# EasyEDA Pro project 步进电机天空星转接板.eprj, board PCB1
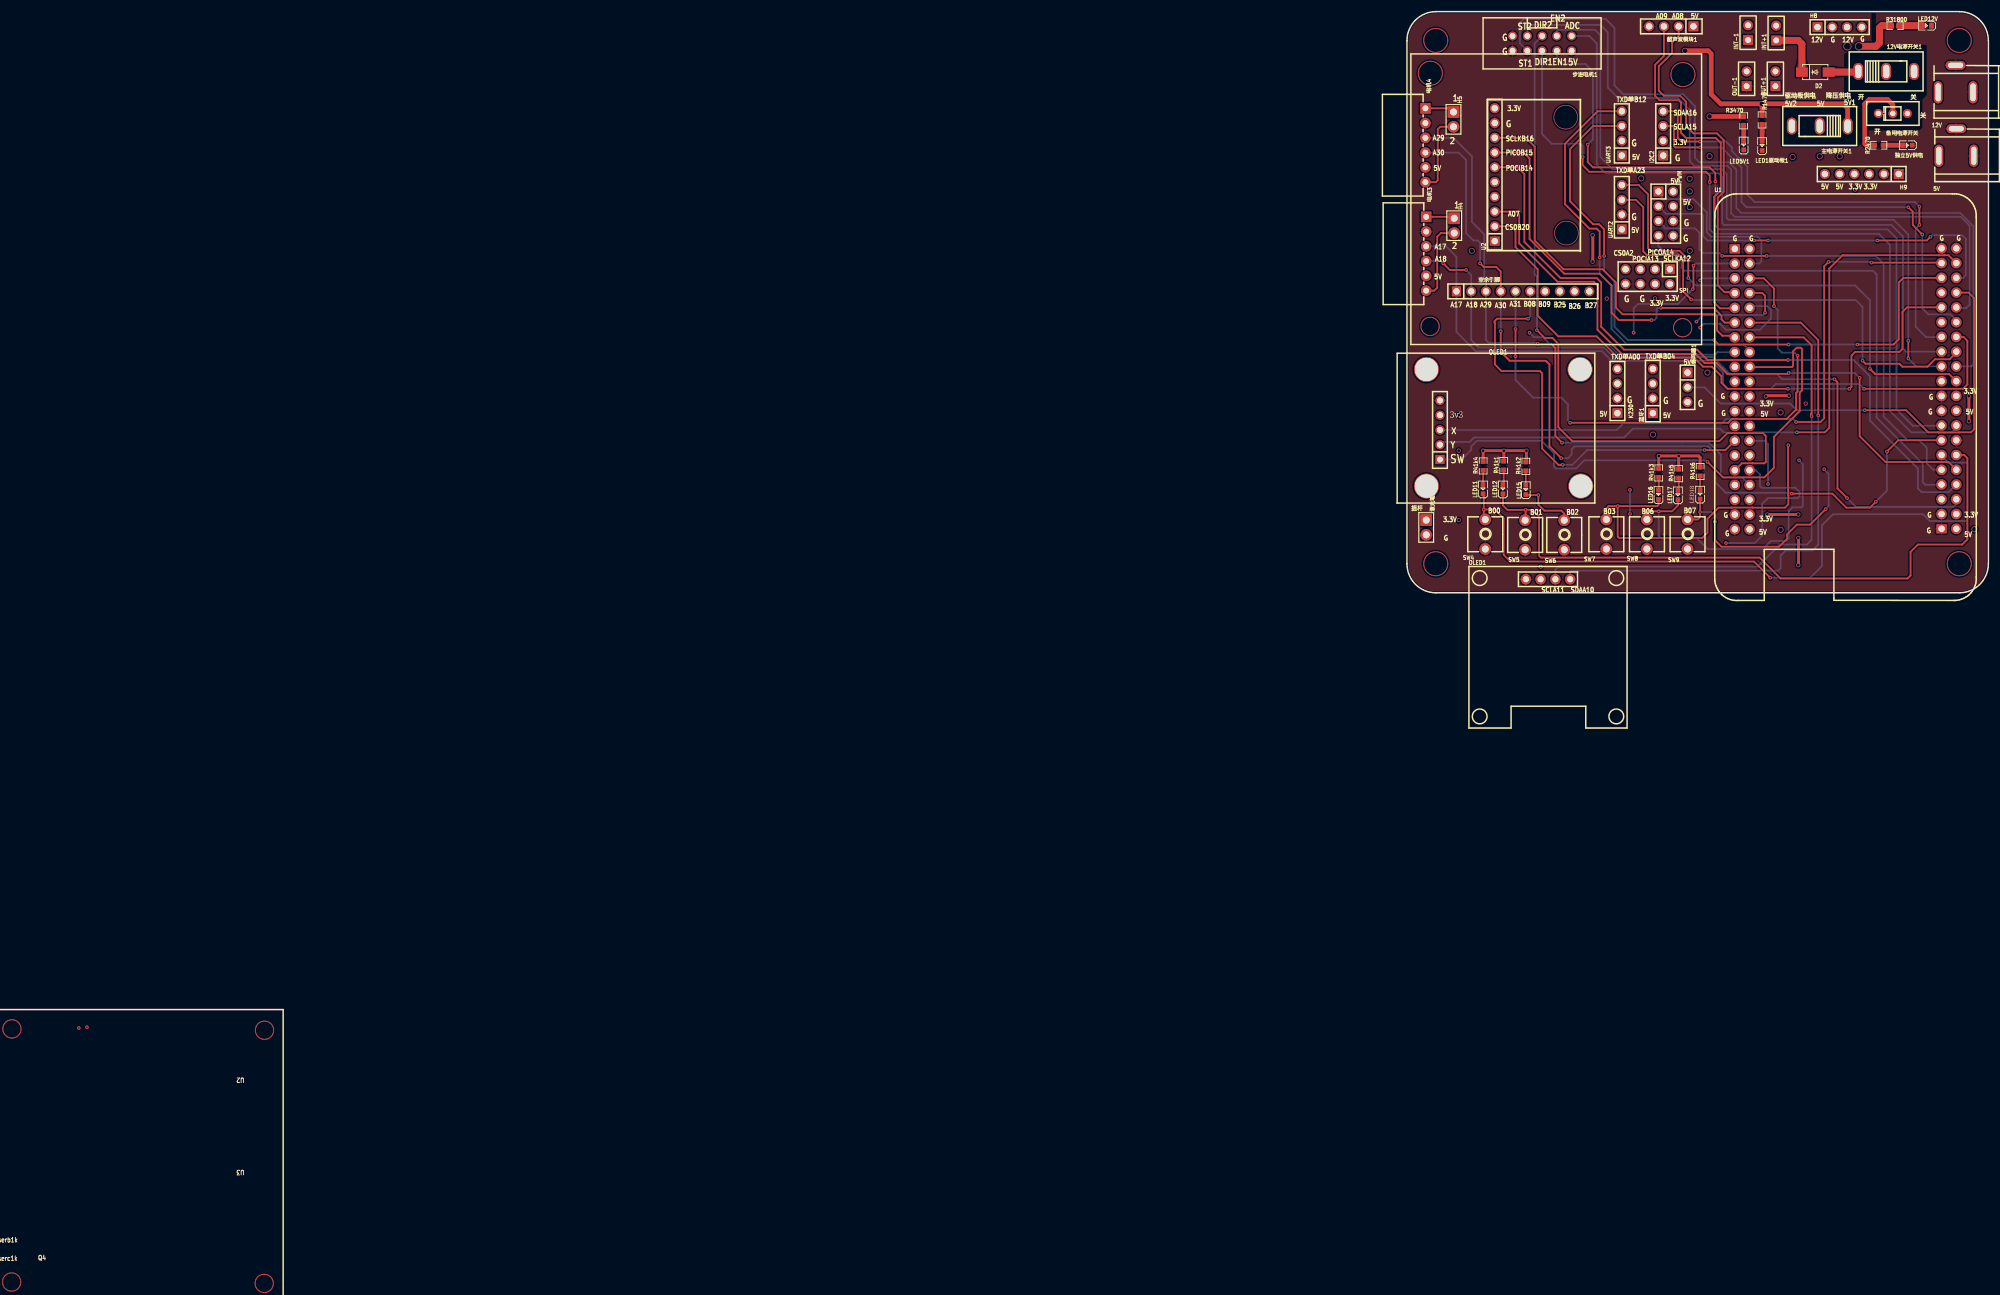
[diagram p2: board, top side]
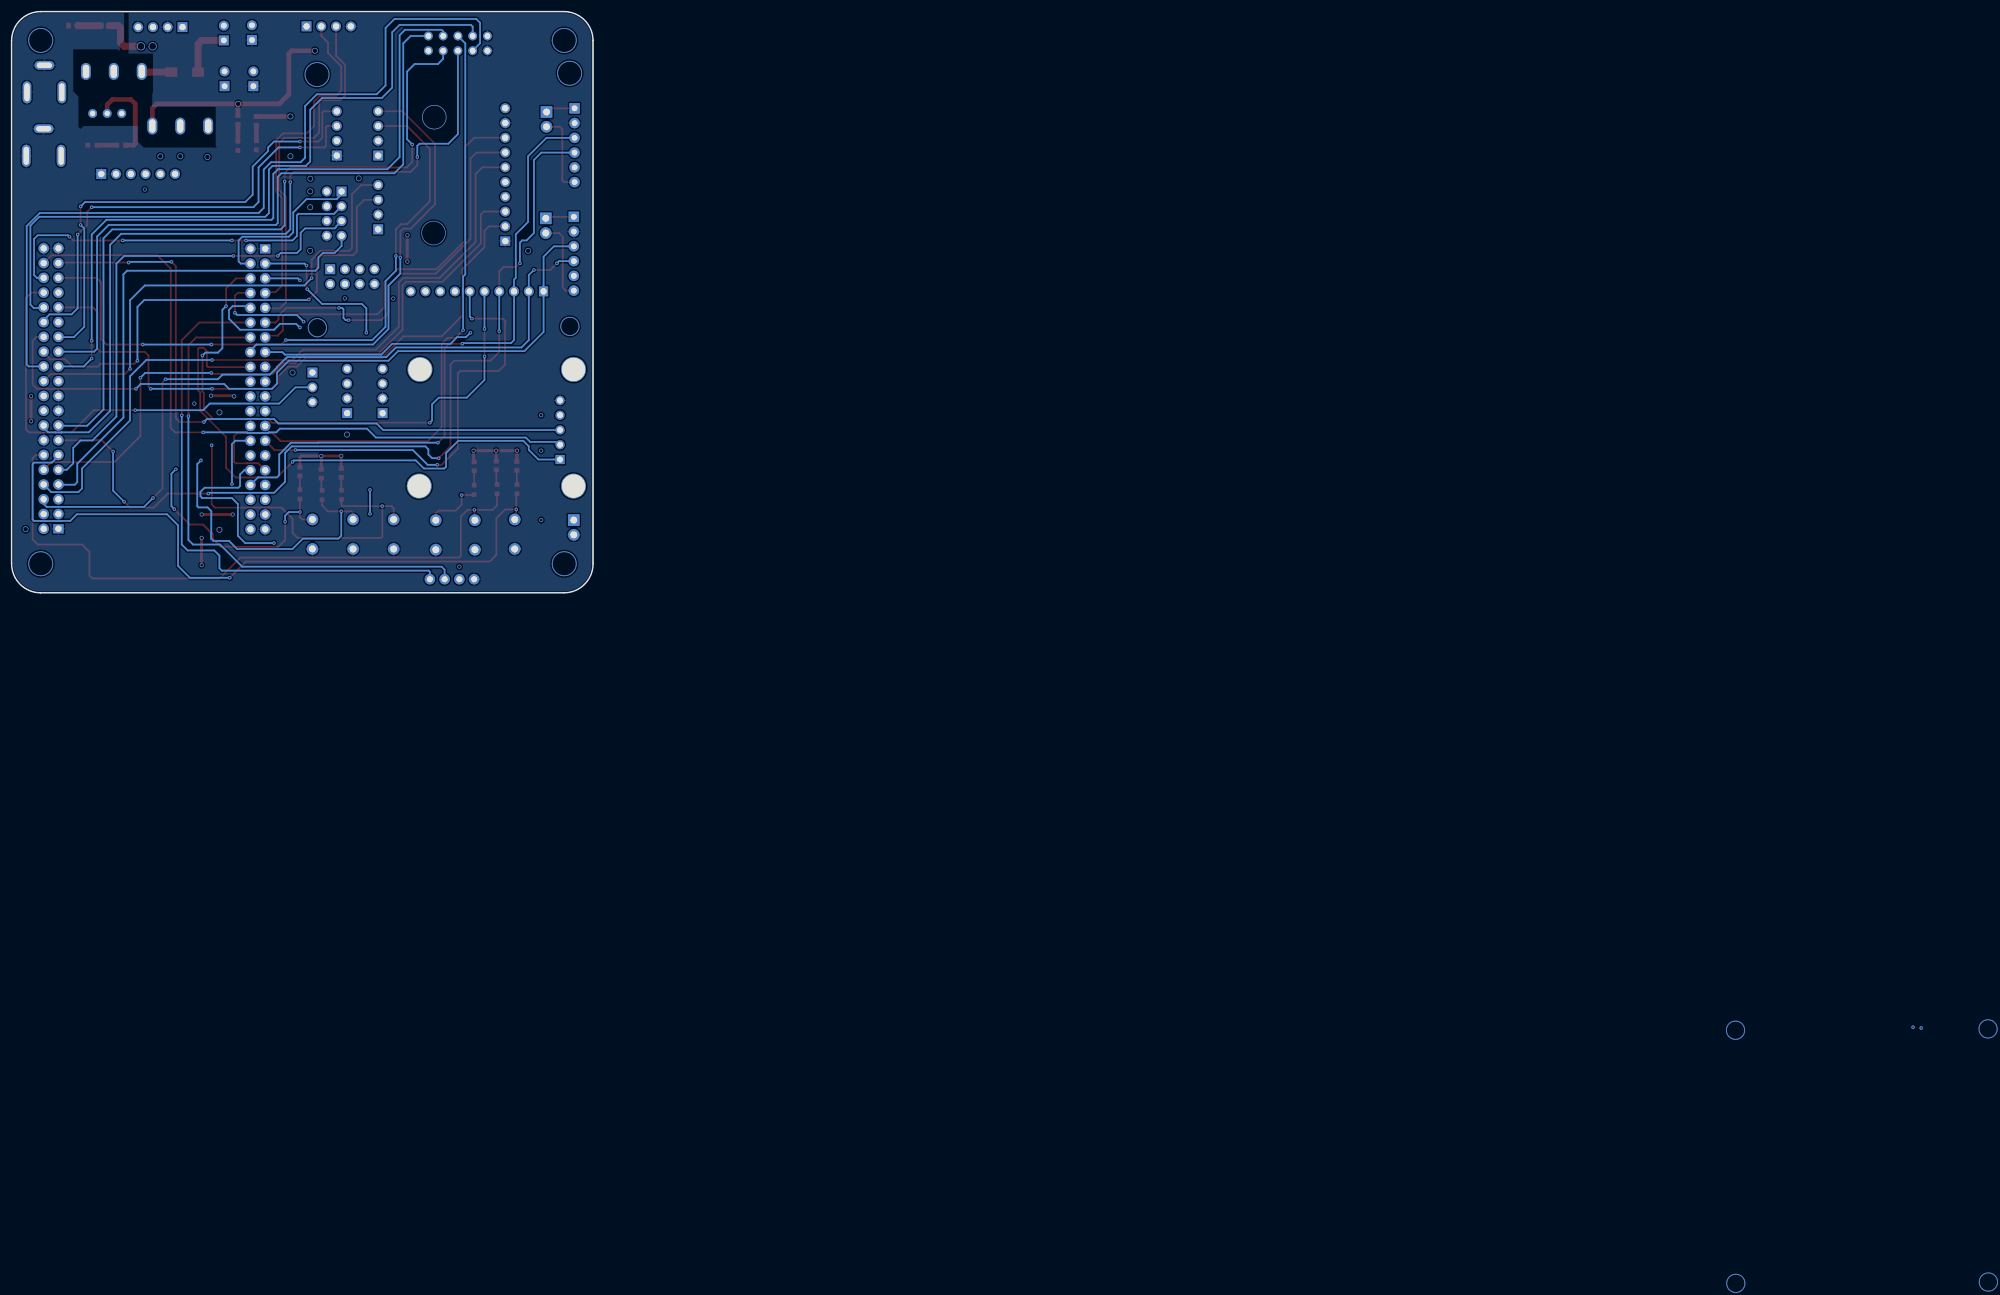
[diagram p3: board, bottom side, seen from below]

Outline 100 x 100 mm; copper layers: Top Layer, Inner1, Inner2, Bottom Layer. Coordinates in mm from the lower left corner of the outline.
Outline path: 0,95 0,5 arc(1.46,1.46) 5,0 95,0 arc(98.54,1.46) 100,5 100,95 arc(98.54,98.54) 95,100 5,100 arc(1.46,98.54) 0,95
Stack: Top Layer 0.035mm 外层铜厚1oz / Dielectric1 0.2104mm 7628 RC49% 8.6mil / Inner1 0.0152mm 内层铜厚 / Dielectric2 1.065mm 1.1mm H/HOZ Copper / Inner2 0.0152mm 内层铜厚 / Dielectric3 0.2104mm 7628 RC49% 8.6mil / Bottom Layer 0.035mm 外层铜厚1oz

## Design rules (mm)
template: 自定义配置
spacing copperThickness1oz (default): track to track 0.102, other pairs 0.152 to 0.3
spacing copperThickness2oz: track to track 0.203, other pairs 0.152 to 0.3
track width copperThickness1oz (default): min 0.3, default 0.3, max 2.54
track width copperThickness2oz: min 0.203, default 0.254, max 2.54
differential pair differentialPair (default): width min 0.127, default 0.254, max 2.54; gap min 0.152, default 0.152
via viaSize (default): diameter min 0.5, default 0.61, max 10; hole min 0.3, default 0.305, max 6.3

## Placement (name value [footprint] x y rotation side)
5V  DC005-T25  [DC-IN-TH_DC-005-20A-1]  94.49 77.52 180 top
12V  DC005-T25  [DC-IN-TH_DC-005-20A-1]  94.36 88.44 180 top
12V电源开关1  SS12D10G5  [SW-TH_SHOU-HAN_SS12D10G4]  82.42 89.71 0 top
D2  SS54  [SMA_L4.3-W2.6-LS5.0-FD]  70.23 89.59 180 top
H4  PZ254V-11-02P  [HDR-TH_2P-P2.54-V-M]  8.13 63.17 270 top
H5  PZ254V-11-02P  [HDR-TH_2P-P2.54-V-M]  8 81.46 270 top
H8  PZ254V-11-04P  [HDR-TH_4P-P2.54-V-M]  74.42 97.33 0 top
H9  PZ254V-11-06P  [HDR-TH_6P-P2.54-V-M]  78.23 72.06 180 top
I2C2  PZ254V-11-04P  [HDR-TH_4P-P2.54-V-M]  44.07 79.05 90 top
INT+1  2.54-1*2P母  [HDR-TH_2P-P2.54-V-F]  63.5 96.32 90 top
INT-1  2.54-1*2P母  [HDR-TH_2P-P2.54-V-F]  58.68 96.38 90 top
K230  PZ254V-11-04P  [HDR-TH_4P-P2.54-V-M]  36.19 34.72 90 top
LED1驱动板1  LTST-C191KSKT  [LED0603-RD-YELLOW#2]  61.09 76.9 90 top
LED5V1  LTST-C191KSKT  [LED0603-RD-YELLOW#2]  57.91 77.01 90 top
LED11  LTST-C191KSKT  [LED0603-RD-YELLOW#2]  13.08 17.83 90 top
LED12  LTST-C191KSKT  [LED0603-RD-YELLOW#2]  16.51 17.83 90 top
LED12V  LTST-C191KSKT  [LED0603-RD-YELLOW]  89.41 97.59 180 top
LED15  LTST-C191KSKT  [LED0603-RD-YELLOW#2]  20.45 17.7 90 top
LED16  LTST-C191KSKT  [LED0603-RD-YELLOW#2]  43.26 16.87 90 top
LED17  LTST-C191KSKT  [LED0603-RD-YELLOW#2]  46.61 16.81 90 top
LED18  LTST-C191KSKT  [LED0603-RD-YELLOW#2]  50.42 16.94 90 top
NOREF  -  [Pad_e98]  29.77 38.43 180 top
NOREF#2  -  [Pad_e97]  29.9 18.37 180 top
NOREF#3  -  [Pad_e100]  3.35 18.37 180 top
NOREF#4  -  [Pad_e99]  3.35 38.43 180 top
OLED1  HS96L03W2C03  [OLED-TH_L27.8-W27.2-P2.54_C9900033791]  24.26 2.34 0 top
OUT+1  2.54-1*2P母  [HDR-TH_2P-P2.54-V-F]  63.37 88.44 90 top
OUT-1  2.54-1*2P母  [HDR-TH_2P-P2.54-V-F]  58.42 88.44 90 top
PWM  PWM  [HDR-TH_8P-P2.54-V-M-R2-C4-S2.54]  44.52 65.24 270 top
R41k1  1kΩ  [R0603#2]  16.64 21.9 90 top
R41k2  1kΩ  [R0603#2]  20.45 21.77 90 top
R41k3  1kΩ  [R0603#2]  43.31 20.62 90 top
R41k4  1kΩ  [R0603#2]  13.11 21.83 90 top
R41k5  1kΩ  [R0603#2]  46.74 20.5 90 top
R41k6  1kΩ  [R0603#2]  50.43 20.87 90 top
R1470  470Ω  [R0603#2]  61.08 81.36 270 top
R2470  470Ω  [R0603#2]  81.15 77.01 0 top
R3470  470Ω  [R0603#2]  57.91 81.2 270 top
R31800  470Ω  [R0603]  83.95 97.59 0 top
SPI  PZ254V-12-8P  [HDR-TH_8P-P2.54-V-M-R2-C4-S2.54]  41.4 54.41 180 top
SW4  K2-1104DZ-G4SW-04  [KEY-TH_2P-L6.0-W6.0-P5.00]  13.46 10.08 90 top
SW5  K2-1104DZ-G4SW-04  [KEY-TH_2P-L6.0-W6.0-P5.00]  20.32 9.96 90 top
SW6  K2-1104DZ-G4SW-04  [KEY-TH_2P-L6.0-W6.0-P5.00]  27.05 9.96 90 top
SW7  K2-1104DZ-G4SW-04  [KEY-TH_2P-L6.0-W6.0-P5.00]  34.29 10.08 90 top
SW8  K2-1104DZ-G4SW-04  [KEY-TH_2P-L6.0-W6.0-P5.00]  41.28 10.08 90 top
SW9  K2-1104DZ-G4SW-04  [KEY-TH_2P-L6.0-W6.0-P5.00]  48.26 10.08 90 top
U1  LCKFB-TMX-MSPM0G3507  [COMM-TH_LCKFB-TMX-MSPM0G3507]  75.44 35.1 0 top
U2  PM2.54-1*10  [HDR-TH_10P-P2.54-V-F]  15.1 71.95 90 top
UART2  2.54-1*4P母  [HDR-TH_4P-P2.54-V-F]  36.96 66.34 90 top
UART3  PZ254V-11-04P  [HDR-TH_4P-P2.54-V-M]  36.96 79.05 90 top
主电源开关1  SS12D10G5  [SW-TH_SHOU-HAN_SS12D10G4]  70.99 80.31 180 top
备用电源开关  SS-12D00-G3  [SW-TH_3P-L8.8-W3.9-P2.50_SS12D00G3]  83.57 82.47 0 top
摇杆1  2.54-1*5P母  [HDR-TH_5P-P2.54-V-F]  5.67 28.02 90 top
步进电机1  2.54-2*5P简牛  [IDC-TH_10P-P2.54_C5665]  23.24 94.54 180 top
激光笔1  PZ254V-11-02P  [HDR-TH_2P-P2.54-V-M]  3.31 11.25 270 top
独立5V供电  LTST-C191KSKT  [LED0603-RD-YELLOW#2]  86.11 77.01 180 top
电机3  XH-6AW  [CONN-TH_6P-P2.54_HCTL_XH-6AW_C2908615]  3.3 58.34 270 top
电机4  XH-6AW  [CONN-TH_6P-P2.54_HCTL_XH-6AW_C2908615]  3.17 77.01 270 top
空余引脚  空余引脚  [HDR-TH_10P-P2.54-V-M]  19.94 51.87 0 top
蓝牙1  2.54-1*4P母  [HDR-TH_4P-P2.54-V-F]  42.29 34.72 90 top
蜂鸣器1  PZ254V-11-03P  [HDR-TH_3P-P2.54-V-M]  48.26 35.36 270 top
超声波模块1  KH-2.54FH-1X4P-H8.5  [HDR-TH_4P-P2.54-V-F]  45.47 97.46 180 top

## Footprints (pads in the part's own frame, mm; a bottom-side part is the same pattern mirrored in y, then rotated)
COMM-TH_LCKFB-TMX-MSPM0G3507
  rect 1.8x1.575 hole 1.1: 1(-19.05,24.09) 41(16.51,-24.09)
  round 1.8 hole 1.1: 2(-16.51,24.09) 3(-19.05,21.549) 4(-16.51,21.549) 5(-19.05,19.009) 6(-16.51,19.009) 7(-19.05,16.47) 8(-16.51,16.47) 9(-19.05,13.93) 10(-16.51,13.93) 11(-19.05,11.389) 12(-16.51,11.389) 13(-19.05,8.85) 14(-16.51,8.85) 15(-19.05,6.309) 16(-16.51,6.309) 17(-19.05,3.769) 18(-16.51,3.769) 19(-19.05,1.23) 20(-16.51,1.23) 21(-19.05,-1.31) 22(-16.51,-1.31) 23(-19.05,-3.85) 24(-16.51,-3.85) 25(-19.05,-6.391) 26(-16.51,-6.391) 27(-19.05,-8.931) 28(-16.51,-8.931) 29(-19.05,-11.47) 30(-16.51,-11.47) 31(-19.05,-14.011) 32(-16.51,-14.011) 33(-19.05,-16.55) 34(-16.51,-16.55) 35(-19.05,-19.09) 36(-16.51,-19.09) 37(-19.05,-21.631) 38(-16.51,-21.631) 39(-19.05,-24.171) 40(-16.51,-24.171) 42(19.05,-24.09) 43(16.51,-21.549) 44(19.05,-21.549) 45(16.51,-19.009) 46(19.05,-19.009) 47(16.51,-16.47) 48(19.05,-16.47) 49(16.51,-13.93) 50(19.05,-13.93) 51(16.51,-11.389) 52(19.05,-11.389) 53(16.51,-8.85) 54(19.05,-8.85) 55(16.51,-6.309) 56(19.05,-6.309) 57(16.51,-3.769) 58(19.05,-3.769) 59(16.51,-1.23) 60(19.05,-1.23) 61(16.51,1.31) 62(19.05,1.31) 63(16.51,3.85) 64(19.05,3.85) 65(16.51,6.391) 66(19.05,6.391) 67(16.51,8.931) 68(19.05,8.931) 69(16.51,11.47) 70(19.05,11.47) 71(16.51,14.011) 72(19.05,14.011) 73(16.51,16.55) 74(19.05,16.55) 75(16.51,19.09) 76(19.05,19.09) 77(16.51,21.631) 78(19.05,21.631) 79(16.51,24.171) 80(19.05,24.171)
CONN-TH_6P-P2.54_HCTL_XH-6AW_C2908615
  rect 1.8x1.8 hole 1: 1(-6.35,0)
  round 1.8 hole 1: 2(-3.81,0) 3(-1.27,0) 4(1.27,0) 5(3.81,0) 6(6.35,0)
DC-IN-TH_DC-005-20A-1
  oval 1.5x3.8 hole 0.9x3.1: 1(3,2.325) 2(-3,2.325)
  oval 3.4x1.5 hole 2.6x0.9: 3(0,-2.325)
HDR-TH_2P-P2.54-V-F
  rect 1.7x1.7 hole 1: 1(-1.27,0)
  round 1.7 hole 1: 2(1.27,0)
HDR-TH_2P-P2.54-V-M
  rect 2x2 hole 1.2: 1(-1.27,0)
  round 2 hole 1.2: 2(1.27,0)
HDR-TH_3P-P2.54-V-M
  rect 1.7x1.7 hole 1.1: 1(-2.54,0)
  round 1.7 hole 1.1: 2(0,0) 3(2.54,0)
HDR-TH_4P-P2.54-V-F
  rect 1.7x1.7 hole 1.1: 1(-3.81,0)
  round 1.7 hole 1.1: 2(-1.27,0) 3(1.27,0) 4(3.81,0)
HDR-TH_4P-P2.54-V-M
  rect 1.7x1.7 hole 1.1: 1(-3.81,0)
  round 1.7 hole 1.1: 2(-1.27,0) 3(1.27,0) 4(3.81,0)
HDR-TH_5P-P2.54-V-F
  rect 1.575x1.575 hole 1.02: 1(-5.08,0)
  round 1.575 hole 1.02: 2(-2.54,0) 3(0,0) 4(2.54,0) 5(5.08,0)
HDR-TH_6P-P2.54-V-M
  rect 1.7x1.7 hole 1.1: 1(-6.35,0)
  round 1.7 hole 1.1: 2(-3.81,0) 3(-1.27,0) 4(1.27,0) 5(3.81,0) 6(6.35,0)
HDR-TH_8P-P2.54-V-M-R2-C4-S2.54
  rect 1.7x1.7 hole 1.1: 1(-3.81,-1.27)
  round 1.7 hole 1.1: 2(-3.81,1.27) 3(-1.27,-1.27) 4(-1.27,1.27) 5(1.27,-1.27) 6(1.27,1.27) 7(3.81,-1.27) 8(3.81,1.27)
HDR-TH_10P-P2.54-V-F
  rect 1.575x1.7 hole 1.1: 1(-11.43,0)
  round 1.7 hole 1.1: 2(-8.89,0) 3(-6.35,0) 4(-3.81,0) 5(-1.27,0) 6(1.27,0) 7(3.81,0) 8(6.35,0) 9(8.89,0) 10(11.43,0)
HDR-TH_10P-P2.54-V-M
  rect 1.575x1.7 hole 1.1: 1(-11.43,0)
  round 1.7 hole 1.1: 2(-8.89,0) 3(-6.35,0) 4(-3.81,0) 5(-1.27,0) 6(1.27,0) 7(3.81,0) 8(6.35,0) 9(8.89,0) 10(11.43,0)
IDC-TH_10P-P2.54_C5665
  round 1.524 hole 1: 1(-5.08,-1.27) 2(-5.08,1.27) 3(-2.54,-1.27) 4(-2.54,1.27) 5(0,-1.27) 6(0,1.27) 7(2.54,-1.27) 8(2.54,1.27) 9(5.08,-1.27) 10(5.08,1.27)
KEY-TH_2P-L6.0-W6.0-P5.00
  round 2 hole 1.2: 1(-2.54,0) 2(2.54,0)
LED0603-RD-YELLOW
  rect 0.8x1 smd: 1(-0.799,-0.004) 2(0.799,0.004)
LED0603-RD-YELLOW#2
  rect 0.8x0.8 smd: 1(-0.799,-0.004) 2(0.799,0.004)
OLED-TH_L27.8-W27.2-P2.54_C9900033791
  round 1.8 hole 1.05: 1(-3.81,0) 2(-1.27,0) 3(1.27,0) 4(3.81,0)
Pad_e97
  round 4.3 hole 4: 1(0,0)
Pad_e98
  round 4.3 hole 4: 1(0,0)
Pad_e99
  round 4.3 hole 4: 1(0,0)
Pad_e100
  round 4.3 hole 4: 1(0,0)
R0603
  rect 1.1x1 smd: 1(-0.753,0)
  rect 1x1 smd: 2(0.753,0)
R0603#2
  rect 0.806x0.864 smd: 1(-0.753,0) 2(0.753,0)
SMA_L4.3-W2.6-LS5.0-FD
  rect 2.046x1.62 smd: 1(-2.304,-0.009) 2(2.304,0.009)
SW-TH_3P-L8.8-W3.9-P2.50_SS12D00G3
  round 1.524 hole 0.914: 1(-2.5,0) 2(0,0) 3(2.5,0)
SW-TH_SHOU-HAN_SS12D10G4
  oval 1.7x2.9 hole 1.1x2.3: 1(-4.8,0) 2(0,0) 3(4.8,0)

## Nets
As in the schematic, except:
GND: 5V.2 5V.3 12V.2 12V.3 H8.2 H8.4 H9.1 H9.2 I2C2.1 INT-1.1 K230.2 LED1驱动板1.1 LED5V1.1 LED12V.1 OLED1.1 OUT-1.1 PWM.6 PWM.8 SPI.6 SPI.8 SW4.1 SW5.1 SW6.1 SW7.1 SW8.1 SW9.1 U1.1 U1.2 U1.21 U1.23 U1.37 U1.39 U1.41 U1.43 U1.54 U1.57 U1.59 U1.79 U1.80 U2.1 U2.9 UART2.2 UART3.2 摇杆1.5 步进电机1.9 步进电机1.10 激光笔1.2 独立5V供电.1 电机3.2 电机4.2 蓝牙1.2 蜂鸣器1.3 超声波模块1.4
V5: 5V.1 R2470.1 备用电源开关.2
V12: 12V.1 12V电源开关1.2
$1N2097: R2470.2 独立5V供电.2

Pads without a net: 12V电源开关1 3; INT+1 2; INT-1 2; NOREF 1; NOREF#2 1; NOREF#3 1; NOREF#4 1; OUT+1 2; OUT-1 2; U2 4 5; 备用电源开关 3

## Via types
v1: diameter 3.3, hole 3, Top Layer to Bottom Layer, 6 vias
v2: diameter 4.3, hole 4, Top Layer to Bottom Layer, 6 vias
v3: diameter 4.2, hole 4, Top Layer to Bottom Layer, 2 vias
v4: diameter 1, hole 0.8, Top Layer to Bottom Layer, 18 vias
v5: diameter 0.61, hole 0.305, Top Layer to Bottom Layer, 90 vias
v6: diameter 1.4, hole 1.2, Top Layer to Bottom Layer, 2 vias
v7: diameter 0.7, hole 0.5, Top Layer to Bottom Layer, 23 vias

## Routing (per net, layer and track width the routed paths; a pad name or vN(x,y) marks a point on that pad's centre or on a via; arc(x,y) is an arc through that point)
3V3: length 467.2
  Top Layer w0.5: v7(46.74,23.55) v7(43.31,23.55) R41k3.2 ; v7(46.74,23.55) 46.74,21.25 R41k5.2 ; v7(46.74,23.55) 50.16,23.55 50.43,23.28 R41k6.2 ; v7(16.66,24.46) 16.66,22.68 R41k1.2 ; v7(16.66,24.46) v7(13.07,24.46) 13.11,24.42 R41k4.2 ; v7(16.66,24.46) v7(20.55,24.46) 20.55,22.62 R41k2.2 ; v7(67.31,4.75) 67.35,4.79 67.35,9.41 v7(67.31,9.45) ; v7(31.92,56.99) 31.96,57.03 31.96,61.48 v7(31.92,61.52) ; v7(61.98,13.47) v7(67.31,13.47) ; v7(65.7,33.92) 61.85,33.92 v7(61.72,33.79) ; v7(96.65,33.83) v7(96.65,29.51)
  Inner1 w0.5: 42.7,50.62 44.86,50.62 45.21,50.98 SPI.2 ; 42.7,50.62 v7(34.36,50.62) ; 42.7,50.62 v7(42.67,50.65) SPI.4 ; v7(8.91,30.56) 摇杆1.4 ; v7(8.91,30.56) v7(8.91,24.46) ; v7(8.91,30.56) 10.44,30.56 10.8,30.91 10.8,42.22 12.57,43.99 34.29,43.99 34.36,44.07 v7(34.36,50.62) ; v7(67.31,4.75) 67.06,4.5 v7(22.99,4.5) ; U1.44 94.53,13.51 96.52,13.51 96.65,13.64 v7(96.65,29.51) ; v7(22.99,4.5) 10.03,4.5 8.91,5.62 v7(8.91,12.52) ; v7(22.99,4.5) OLED1.2 ; 31.92,88.06 40.13,88.06 41.15,87.05 41.15,78.28 41.66,77.78 I2C2.2 ; 31.92,88.06 23.24,88.06 18.56,83.38 U2.10 ; 31.92,88.06 v7(31.92,61.52) ; U1.60 94.53,33.83 v7(96.65,33.83) 96.65,34.72 96.9,34.98 97.66,34.98 98.02,35.33 98.02,65.36 96.14,67.23 77.44,67.23 77.09,67.59 v7(77.09,69.39) ; U1.38 v7(61.98,13.47) ; H9.4 77.09,71.93 v7(77.09,69.39) ; v7(31.92,56.99) 32.35,56.57 33.4,56.57 33.91,56.06 33.91,50.98 34.26,50.62 v7(34.36,50.62) ; v7(8.91,24.46) v7(13.07,24.46) ; v7(8.91,24.46) v7(8.91,12.52) ; U1.22 v7(61.72,33.79) ; v7(8.91,12.52) 3.31,12.52 ; v7(68.58,32.56) 67.06,32.56 v7(65.7,33.92) ; v7(68.58,32.56) 69.6,32.56 69.95,32.92 69.95,67.21 72.14,69.39 v7(77.09,69.39) ; v7(68.58,32.56) 68.58,14.74 v7(67.31,13.47) v7(67.31,9.45) ; v7(20.55,24.46) 41.12,24.46 42.04,23.55 v7(43.31,23.55) ; v7(77.09,69.39) 78.88,69.39 79.5,70.02 H9.3
5V: length 399.1
  Top Layer w0.8: R3470.1 52.05,81.96 v4(52.04,81.97)
  Inner1 w0.8: 74.41,75.11 v4(74.42,75.1) H9.5 ; 74.41,75.11 80.65,75.11 81.19,75.66 81.19,82.35 备用电源开关.1 ; 74.41,75.11 v4(70.99,75.11) ; 超声波模块1.1 51.69,97.46 52.04,97.1 v4(52.04,81.97) v4(52.04,75.11) ; v4(48.64,66.34) v4(48.64,58.85) ; v4(48.64,66.34) 45.96,66.34 PWM.4 ; v4(48.64,66.34) v4(48.64,69.07) ; v4(48.64,58.85) v4(11.15,58.85) ; v4(48.64,58.85) 51.69,55.8 v4(51.69,37.9) ; 40.25,71.26 v4(40.3,71.3) 40.19,71.3 40.18,71.3 ; 40.25,71.26 v4(48.62,71.26) 48.63,71.26 48.64,71.26 ; 40.25,71.26 40.22,71.26 40.18,71.3 ; 40.25,71.26 40.25,63.67 38.99,62.41 37.08,62.41 UART2.1 ; v4(64.26,31.04) 59.52,31.04 59.44,31.13 ; v4(64.26,31.04) v4(64.26,10.85) ; v4(64.26,31.04) 64.26,70.16 66.33,72.22 v4(66.33,74.98) ; v4(42.31,27.23) 50.42,27.23 51.69,28.5 v4(51.69,37.9) ; v4(42.31,27.23) 42.29,27.25 蓝牙1.1 ; v4(42.31,27.23) 36.83,27.23 36.19,27.86 K230.1 ; 40.18,71.3 40.18,74.67 39.62,75.23 UART3.1 ; v4(97.59,10.94) 98.3,11.65 98.3,30.53 97.54,31.29 94.53,31.29 U1.58 ; v4(97.59,10.94) 97.59,9.25 97.03,8.69 89.79,8.69 88.14,7.04 66.5,7.04 64.26,9.27 v4(64.26,10.85) ; v4(97.59,10.94) 94.56,10.94 U1.42 ; H9.6 70.99,72.95 v4(70.99,75.11) ; v4(52.04,75.11) 53,74.16 63.94,74.16 64.77,74.98 v4(66.33,74.98) ; v4(52.04,75.11) 50.16,75.11 49.4,74.35 49.4,72.02 48.64,71.26 ; v4(64.26,10.85) 59.48,10.85 59.44,10.81 ; 主电源开关1.2 v4(70.99,75.11) ; v4(70.99,75.11) 70.87,74.98 v4(66.33,74.98) ; v4(11.15,58.85) 9.27,58.85 7.75,57.33 7.75,55.55 6.6,54.41 3.43,54.41 电机3.5 ; v4(11.15,58.85) 11.15,71.83 9.78,73.2 电机4.5 ; v4(51.69,37.9) 蜂鸣器1.1 ; PWM.2 48.62,69.05 v4(48.64,69.07) ; 48.64,71.26 v4(48.64,69.07)
5V1: length 60.8
  Top Layer w0.8: v4(61.03,84.12) 53.97,84.12 52.32,85.78 52.32,92.76 51.82,93.27 v4(47.84,93.27) ; v4(61.03,84.12) 61.08,84.08 R1470.1 ; v4(61.03,84.12) 75.06,84.12 75.79,83.39 主电源开关1.1
  Inner1 w0.8: 步进电机1.2 v4(47.84,93.27)
5V2: length 9.4
  Inner1 w0.8: OUT+1.1 65.79,87.17 66.19,86.77 主电源开关1.3
12V: length 31.2
  Top Layer w1.2: D2.1 77.51,89.6 12V电源开关1.1 ; R31800.1 81.66,97.59 81.28,97.21 81.28,94.67 80.65,94.03 v6(77.75,94.03)
  Inner1 w1.2: v6(75.75,94.03) 75.75,97.28 H8.3 ; v6(75.75,94.03) 71.37,94.03 70.74,94.67 70.74,97.21 H8.1 ; v6(75.75,94.03) v6(77.75,94.03) 77.75,89.84 12V电源开关1.1
V5: length 30.6
  Top Layer w0.8: 备用电源开关.2 83.57,84 82.68,84.89 79.5,84.89 78.74,84.12 78.74,77.27 78.99,77.01 R2470.1
  Inner1 w0.8: 备用电源开关.2 83.82,82.22 83.82,75.62 84.46,74.98 91.27,74.98 5V.1
V12: length 12.1
  Inner1 w1.2: 12V.1 91.19,86.28 82.93,86.28 82.42,86.79 12V电源开关1.2
(no net):
  vias: v1(-239.99,-118.58) v1(-239.94,-75.03) v1(-196.55,-118.81) v1(-196.5,-75.26) v1(3.97,45.84) v1(47.42,45.61) v2(4.03,89.4) v2(4.95,95.05) v2(4.95,5) v2(47.47,89.17) v2(95,95.05) v2(95,5) v3(27.31,81.84) v3(27.43,61.9)
M31: length 4.9
  Top Layer w0.3: 电机3.1 7.87,64.69 H4.1
M32: length 14.1
  Top Layer w0.3: H4.2 5.84,61.9 5.21,61.27 5.21,52.5 4.7,51.99 电机3.6
M41: length 5.1
  Top Layer w0.3: H5.1 7.37,83.36 电机4.1
M42: length 13.9
  Top Layer w0.3: 电机4.6 4.99,70.66 5.29,70.96 5.29,79.76 5.72,80.19 H5.2
PA00: length 35.8
  Top Layer w0.3: v5(49.15,52.25) 49.28,52.38 v5(49.28,56.31)
  Inner1 w0.3: v5(38.99,44.75) 38.99,39.04 38.48,38.53 K230.4
  Bottom Layer w0.3: v5(49.28,56.31) 49.62,56.65 U1.3 ; v5(49.15,52.25) 46.61,49.71 39.75,49.71 38.99,48.95 v5(38.99,44.75)
PA01: length 35.2
  Inner1 w0.3: K230.3 39.12,35.99 39.62,36.5 39.62,43.87 40.89,45.14 42.67,45.14 43.31,45.77 43.31,47.42 44.2,48.31 48.77,48.31 50.42,49.96 v5(50.42,53.77)
  Bottom Layer w0.3: v5(50.42,53.77) 50.76,54.11 U1.5
PA02: length 106.4
  Inner2 w0.3: U1.61 90.34,36.41 89.41,35.48 89.41,20.01 89.15,19.75 54.85,19.75 52.83,21.77 52.83,41.07 52.32,41.58 38.23,41.58 36.07,43.74 36.07,55.42 36.32,55.68 SPI.7
PA07: length 111.2
  Top Layer w0.3: U2.3 18.78,65.6 19.3,65.08 19.3,60.12 25.91,53.52 32.13,53.52 32.77,52.88 32.77,45.26 36.96,41.07 49.66,41.07 51.18,39.55 53.21,39.55 55.09,37.67 65.5,37.67 v5(65.66,37.83) ; v5(77.85,37.01) 77.85,26.97 82.31,22.51 93.15,22.51 U1.50
  Bottom Layer w0.3: v5(65.66,37.83) 77.03,37.83 v5(77.85,37.01)
PA08: length 58.5
  Top Layer w0.3: 超声波模块1.2 46.74,95.81 45.59,94.67 45.59,92.89 43.31,90.6 43.31,86.41 44.2,85.52 46.99,85.52 48.01,84.51 48.01,80.31 49.28,79.05 53.34,79.05 54.48,77.9 54.48,69.01 53.47,68 53.47,52.88 54.61,51.74 56.22,51.74 U1.7
PA09: length 62.2
  Top Layer w0.3: 超声波模块1.3 44.2,92.38 42.67,90.86 42.67,85.52 43.43,84.76 46.74,84.76 47.12,84.38 47.12,79.17 48.01,78.28 53.09,78.28 53.97,77.39 53.97,69.27 52.83,68.12 52.83,49.96 53.85,48.95 56.3,48.95 U1.9
PA10: length 95.4
  Top Layer w0.3: v5(70.74,30.53) 70.74,43.48 67.73,46.49 U1.12
  Bottom Layer w0.3: v5(70.74,30.53) 70.74,8.31 69.72,7.29 65.15,7.29 64.26,6.4 64.26,4.24 63.84,3.82 28.28,3.82 28.07,3.61 OLED1.4
PA11: length 92.6
  Top Layer w0.3: v5(69.6,30.4) 69.5,30.5 69.5,30.78 69.6,30.88 69.6,42.6 68.24,43.95 U1.14
  Bottom Layer w0.3: OLED1.3 25.53,3.99 26.03,4.5 60.32,4.5 64.13,8.31 68.79,8.31 69.6,9.11 v5(69.6,30.4)
PA12: length 41.3
  Inner2 w0.3: SPI.1 47.88,55.68 48.26,55.3 51.82,55.3 54.36,52.76 54.36,24.05 54.78,23.63 U1.29
PA13: length 52.1
  Inner2 w0.3: SPI.5 38.86,54.41 38.86,50.34 41.02,48.18 52.71,48.18 53.59,47.3 53.59,23.16 54.33,22.43 57.73,22.43 U1.30
PA14: length 58.4
  Inner2 w0.3: U1.69 90,46.57 87.88,48.69 87.88,55.12 87.58,55.42 54.61,55.42 52.45,57.58 44.58,57.58 SPI.3
PA15: length 78.8
  Top Layer w0.3: v5(86.23,66.34) 87,65.58 87,63.3 v5(88.65,61.65) ; I2C2.3 45.72,80.31 45.93,80.1 45.93,76.89 46.19,76.63 v5(50.42,76.63)
  Bottom Layer w0.3: v5(88.65,61.65) 88.65,48.95 89.68,47.91 93.49,47.91 94.49,46.91 U1.70 ; v5(50.42,76.63) 54.1,76.63 57.53,73.2 57.53,67.23 58.42,66.34 v5(86.23,66.34)
PA16: length 82.8
  Top Layer w0.3: I2C2.4 46.35,82.86 46.57,82.64 46.57,78.28 47.2,77.65 v5(50.42,77.65) ; v5(88.14,66.47) v5(88.14,63.3)
  Bottom Layer w0.3: v5(50.42,77.65) 54.86,77.65 55.88,76.63 55.88,76 58.55,73.33 58.55,68.5 59.82,67.23 87.38,67.23 v5(88.14,66.47) ; U1.67 91.91,43.99 89.28,43.99 87.5,45.77 87.5,62.66 v5(88.14,63.3)
PA17: length 122.6
  Top Layer w0.3: v5(78.61,35.1) 95.63,35.1 96.39,35.86 96.39,43.36 95.72,44.03 U1.68
  Bottom Layer w0.3: v5(78.61,35.1) 77.79,35.93 63.44,35.93 62.61,35.1 55.25,35.1 54.36,35.99 54.36,37.9 52.32,39.93 35.18,39.93 33.53,41.58 11.81,41.58 8.51,44.88 空余引脚.1 8.51,57.84 6.73,59.61 电机3.3
PA18: length 127
  Top Layer w0.3: v5(73.53,36.75) 74.04,36.25 74.04,17.96 v5(75.69,16.31) ; v5(6.22,56.69) 7.37,55.55 v5(10.16,55.55)
  Bottom Layer w0.3: U1.46 94.49,15.29 93.98,14.78 77.22,14.78 v5(75.69,16.31) ; v5(6.22,56.69) 5.84,57.07 电机3.4 ; v5(73.53,36.75) 64.52,36.75 63.74,37.53 55.61,37.53 54.38,38.77 54.38,38.83 52.87,40.33 52.81,40.33 52.58,40.56 35.56,40.56 33.91,42.22 12.32,42.22 11.05,43.48 空余引脚.2 11.05,54.66 v5(10.16,55.55)
PA21: length 140.1
  Bottom Layer w0.3: U1.64 97.07,38.95 97.41,39.29 97.41,63.1 95.16,65.35 57.51,65.35 56.64,66.22 56.64,72.82 55.37,74.09 50.29,74.09 49.53,74.85 49.53,83.74 47.5,85.78 37.21,85.78 35.69,87.3 35.69,97.21 34.16,98.73 20.07,98.73 19.43,98.09 19.43,94.54 步进电机1.8
PA22: length 123.4
  Bottom Layer w0.3: U1.72 94.59,49.01 96.2,49.01 96.77,49.58 96.77,63.17 95.25,64.69 56.39,64.69 55.75,65.33 55.75,72.82 55.12,73.46 49.4,73.46 48.64,74.22 48.64,83.11 46.61,85.14 36.32,85.14 34.54,86.92 34.54,96.44 33.27,97.71 21,97.71 20.7,97.41 步进电机1.7
PA23: length 85.7
  Top Layer w0.3: v5(48.39,54.15) 48.39,57.33 46.86,58.85 41.91,58.85 41.47,59.3 41.47,68.57 39.88,70.16 UART2.4 ; v5(79.63,38.53) 80.52,37.64 93.26,37.64 U1.62
  Bottom Layer w0.3: v5(48.39,54.15) 49.66,52.88 77.09,52.88 79.63,50.34 v5(79.63,38.53)
PA24: length 66.1
  Top Layer w0.3: v5(90.04,61.27) 89.41,60.63 v5(80.9,60.63) ; v5(59.69,60.63) v5(62.1,60.63)
  Bottom Layer w0.3: v5(59.69,60.63) 51.69,60.63 50.93,61.39 50.93,64.95 50.67,65.2 44.56,65.2 PWM.3 ; U1.76 95.67,54.19 96.14,54.66 96.14,60.88 95.5,61.52 90.3,61.52 v5(90.04,61.27) ; v5(62.1,60.63) v5(80.9,60.63)
PA25: length 112.9
  Top Layer w0.3: v5(65.63,42.72) 53.59,42.72 v5(52.83,43.48) ; UART3.3 32,80.31 28.07,76.38 28.07,67.36 32,63.42 33.02,63.42 33.91,62.53 v5(33.91,57.96) ; v5(77.47,42.72) 83.69,42.72 84.58,43.61 84.58,53.39 85.38,54.19 U1.75
  Bottom Layer w0.3: v5(65.63,42.72) v5(77.47,42.72) ; v5(52.83,43.48) 37.97,43.48 35.69,45.77 35.69,53.64 33.91,55.42 v5(33.91,57.96)
PA26: length 119.6
  Top Layer w0.3: v5(67.06,27.61) 71.88,27.61 72.64,28.37 72.64,55.8 74.93,58.09 91.43,58.09 91.45,58.07 92.45,58.07 92.46,58.09 93.13,58.09 U1.78
  Bottom Layer w0.3: 摇杆1.2 6.16,25.96 10.8,25.96 11.56,26.72 37.34,26.72 38.86,28.25 53.85,28.25 54.48,27.61 55.79,27.61 55.89,27.51 59.43,27.51 59.53,27.61 v5(67.06,27.61)
PA27: length 114.1
  Top Layer w0.3: v5(72.52,56.95) 71.75,56.19 71.75,30.02 71.12,29.39 v5(66.93,29.39) ; v5(79.88,56.82) 91.86,56.82 U1.77
  Bottom Layer w0.3: 摇杆1.3 36.09,28.02 37.21,29.13 54.1,29.13 54.86,29.9 55.87,29.9 55.89,29.91 59.43,29.91 59.44,29.9 66.42,29.9 v5(66.93,29.39) ; v5(72.52,56.95) 79.76,56.95 v5(79.88,56.82)
PA28: length 29.3
  Bottom Layer w0.3: PWM.1 43.25,68.56 44.07,67.74 49.28,67.74 51.56,65.46 51.56,62.03 52.32,61.27 60.32,61.27 60.96,60.63 60.96,57.03 60.58,56.65 U1.4
PA29: length 108.5
  Top Layer w0.3: v5(26.67,25.83) 25.53,26.97 25.53,42.09 24.77,42.85 v5(22.48,42.85)
  Bottom Layer w0.3: v5(22.48,42.85) 22.35,42.98 14.1,42.98 13.59,43.48 空余引脚.3 13.59,53.9 13.29,54.2 13.29,61.69 11.18,63.81 11.18,75.11 8,78.28 电机4.3 ; v5(26.67,25.83) 47.33,25.83 47.35,25.81 51.96,25.81 53.97,23.8 53.97,20.24 54.36,19.86 57.62,19.86 U1.34
PA30: length 153.7
  Top Layer w0.3: v5(16.13,45.01) 16.13,41.45 17.65,39.93 23.88,39.93 24.51,39.29 24.51,25.2 v5(26.54,23.16) ; v5(82.55,24.31) 84.5,26.25 U1.53 ; v5(12.57,56.69) 13.21,56.06 15.37,56.06 16.13,55.3 空余引脚.4 ; v5(80.65,15.67) 79.63,14.66 75.56,14.66 73.15,17.07 v5(66.17,17.07)
  Bottom Layer w0.3: v5(26.54,23.16) 27.69,23.16 28.32,23.8 28.32,24.69 28.83,25.2 51.82,25.2 52.96,24.05 52.96,19.1 54.85,17.21 66.02,17.21 v5(66.17,17.07) ; v5(12.57,56.69) 12.57,60.25 12.19,60.63 11.43,60.63 10.16,61.9 10.16,74.47 8.89,75.74 电机4.4 ; v5(80.65,15.67) 82.55,17.58 v5(82.55,24.31) ; 空余引脚.4 v5(16.13,45.01)
PA31: length 97.9
  Top Layer w0.3: v5(63.12,49.33) 63.12,52.38 61.38,54.11 U1.6 ; v5(18.67,45.39) v5(18.67,40.69) ; v5(28.07,29.26) 55.24,29.26 55.89,29.91 65.3,29.91 66.93,31.55 66.93,34.4 67.18,34.66 v5(67.18,40.82)
  Bottom Layer w0.3: v5(28.07,29.26) 27.69,29.64 27.69,32.44 26.54,33.58 21.72,33.58 18.67,36.63 v5(18.67,40.69) ; 空余引脚.5 v5(18.67,45.39) ; v5(67.18,40.82) 66.68,41.33 64.52,41.33 63.75,42.09 63.75,48.69 v5(63.12,49.33)
PB00: length 120.2
  Top Layer w0.3: LED11.1 13.21,16.91 v5(13.21,14.33) ; v5(13.21,14.33) 13.21,12.88 SW4.2 ; v5(13.21,14.33) 15.11,14.33 16.64,12.81 16.64,6.53 17.78,5.38 59.69,5.38 v5(62.48,2.59)
  Bottom Layer w0.3: U1.51 91.95,23.55 93.09,22.4 96.14,22.4 96.39,22.15 96.39,12.62 96.14,12.37 95,12.37 94.99,12.35 91.45,12.35 91.43,12.37 89.92,12.37 88.77,13.51 73.28,13.51 71.37,11.61 71.37,4.62 69.34,2.59 v5(62.48,2.59)
PB01: length 114.1
  Top Layer w0.3: LED12.1 16.51,15.04 17.28,14.28 v5(20.41,14.28) ; U1.52 95.84,23.71 96.39,23.16 96.39,9.19 95.5,8.31 87.88,8.31 86.61,7.04 86.61,2.97 86.11,2.46 64.26,2.46 60.66,6.07 23.03,6.07 22.73,6.37 22.73,13.13 21.59,14.28 v5(20.41,14.28) ; v5(20.41,14.28) 20.41,12.58 SW5.2
PB02: length 76.9
  Top Layer w0.3: LED15.1 20.54,16.81 v5(22.61,16.81) 22.61,15.16 23.62,14.15 26.54,14.15 27.05,13.64 SW6.2
  Inner2 w0.3: v5(21.08,44.75) 20.45,44.75 20.07,44.37 20.07,30.91 22.61,28.37 v5(22.61,16.81)
  Bottom Layer w0.3: v5(21.08,44.75) 21.84,43.99 23.37,43.99 24.51,42.85 34.54,42.85 36.41,40.99 53,40.99 53.43,41.41 U1.15
PB03: length 85.5
  Top Layer w0.3: SW7.2 34.29,14.53 34.67,14.91 v5(36.26,14.91) ; v5(36.26,14.91) 43.05,14.91 43.27,15.12 LED16.1 ; v5(36.26,14.91) 36.24,14.89 36.24,9.66 36.45,9.45 50.8,9.45 51.69,10.34 51.69,12.75 53.59,14.66 55.87,14.66 55.89,14.67 59.43,14.67 59.44,14.66 65.02,14.66 65.6,15.23 65.6,16.78 65.56,16.82 65.56,25.35 v5(65.6,25.39)
  Inner2 w0.3: U1.17 57.57,40.06 58.41,40.06 58.43,40.07 59.43,40.07 59.44,40.06 61.21,40.06 64.64,36.63 67.06,36.63 67.44,36.25 67.44,31.67 65.6,29.83 v5(65.6,25.39)
PB04: length 32.6
  Top Layer w0.3: U1.8 58.97,51.61 61.09,51.61 61.59,51.11 v5(61.59,48.18)
  Inner1 w0.3: v5(49.78,46.66) 49.53,46.41 49.53,42.6 48.98,42.05 45.55,42.05 45.09,41.58 45.09,39.42 44.2,38.53 蓝牙1.4
  Bottom Layer w0.3: v5(49.78,46.66) 50.93,47.8 61.21,47.8 v5(61.59,48.18)
PB05: length 35.8
  Inner1 w0.3: 蓝牙1.3 44.96,35.99 45.85,36.88 45.85,40.82 46.23,41.2 49.53,41.2 50.42,42.09 v5(50.42,45.64)
  Bottom Layer w0.3: U1.10 59.22,49.33 61.98,49.33 62.61,48.69 62.61,47.17 60.71,45.26 54.86,45.26 53.85,46.28 51.05,46.28 v5(50.42,45.64)
PB06: length 70.2
  Top Layer w0.3: SW8.2 41.15,12.75 41.15,13.59 41.57,14.02 v5(43.31,14.02) 45.59,14.02 46.61,15.04 LED17.1
  Inner2 w0.3: v5(67.44,22.78) 67.44,23.8 67.18,24.05 64.9,24.05 64.64,24.31 64.64,29.51 64.13,30.02 57.7,30.02 U1.25
  Bottom Layer w0.3: v5(67.44,22.78) 68.07,22.15 68.07,14.91 67.86,14.7 66.29,14.7 65.66,14.06 65.66,10.25 65.68,10.23 65.68,9.32 65.29,8.93 62.6,8.93 61.21,7.54 51.69,7.54 49.91,9.32 43.81,9.32 43.31,9.83 v5(43.31,14.02)
PB6:
  vias: v5(-227.04,-74.75)
PB07: length 61.3
  Top Layer w0.3: LED18.1 50.42,13 50.04,12.62 SW9.2 ; v5(72.01,14.4) 69.34,11.74 67.06,11.74 65.41,10.08 65.41,9.32 64.01,7.93 54.1,7.93 52.96,9.07 v5(52.96,12.24)
  Inner2 w0.3: v5(71.75,21.26) 65.28,21.26 63.5,23.04 63.5,27.99 62.78,28.71 U1.26
  Bottom Layer w0.3: v5(72.01,14.4) 72.52,14.91 72.52,20.5 v5(71.75,21.26) ; v5(52.96,12.24) 52.96,13.26 52.32,13.89 v5(50.42,13.89)
PB7:
  vias: v5(-228.44,-74.88)
PB08: length 76
  Top Layer w0.3: v5(51.18,24.56) 54.78,24.56 U1.27 ; v5(20.83,47.17) 15.49,47.17 15.07,46.75 15.07,46.45 15.13,46.38 15.13,39.27 16.26,38.15 22.86,38.15 23.24,37.77 23.24,24.82 26.03,22.02 v5(26.8,22.02)
  Bottom Layer w0.3: 空余引脚.6 21.21,47.55 v5(20.83,47.17) ; v5(26.8,22.02) 28.45,22.02 30.99,24.56 v5(51.18,24.56)
PB09: length 85
  Inner2 w0.3: v5(62.1,18.72) 62.1,14.91 61.85,14.66 59.44,14.66 59.43,14.67 55.89,14.67 55.87,14.66 38.99,14.66 37.08,16.56 37.08,23.67 35.69,25.07 28.57,25.07 23.75,29.9 23.75,43.99 23.78,44.02 23.78,44.09 23.75,44.12 空余引脚.7
  Bottom Layer w0.3: U1.28 61.51,26.17 62.1,25.58 v5(62.1,18.72)
PB10: length 85.1
  Top Layer w0.3: v5(54.23,57.96) v5(61.85,57.96)
  Bottom Layer w0.3: v5(54.23,57.96) 53.72,58.47 50.93,58.47 50.29,59.11 50.29,61.94 49.53,62.7 44.41,62.7 44.2,62.92 44.2,63.02 PWM.5 ; v5(61.85,57.96) 80.65,57.96 81.98,56.63 81.98,30.34 86.11,26.21 88.14,26.21 89.41,24.94 89.41,22.28 90.51,21.17 U1.49
PB11: length 84.8
  Bottom Layer w0.3: U1.47 91.91,18.59 89.15,18.59 88.71,19.04 88.71,22.21 80.77,30.15 80.77,54.79 80.14,55.42 47.75,55.42 47.24,55.93 47.24,57.71 46.48,58.47 44.45,58.47 43.25,59.67 PWM.7
PB12: length 73.6
  Top Layer w0.3: v5(33.15,57.71) 33.15,62.15 32.64,62.66 31.37,62.66 27.18,66.85 27.18,77.27 32.77,82.86 UART3.4
  Bottom Layer w0.3: v5(33.15,57.71) 33.15,54.92 35.18,52.88 35.18,45.39 37.85,42.72 57.91,42.72 58.93,41.71 U1.16
PB13: length 99.4
  Top Layer w0.3: U1.18 58.97,38.83 66.21,38.83 66.42,39.04 66.42,41.56 67.03,42.17 67.73,42.17 67.94,41.96 67.94,34.85 67.55,34.45 67.55,31.28 63.12,26.85 63.12,21.51 61.47,19.86 54.36,19.86 v5(51.69,22.53)
  Bottom Layer w0.3: 摇杆1.1 9.4,22.94 11.05,24.59 11.05,25.2 12,26.15 23.18,26.15 25.27,24.05 25.27,21.69 25.57,21.39 29.08,21.39 30.48,22.78 51.44,22.78 v5(51.69,22.53)
PB14: length 120.9
  Top Layer w0.3: v5(65.53,40.06) 59.44,40.06 59.43,40.07 55.89,40.07 55.87,40.06 51.69,40.06 49.91,41.83 37.34,41.83 33.4,45.77 33.4,53.39 32.64,54.15 26.42,54.15 20.19,60.38 20.19,72.06 19.04,73.22 U2.6
  Bottom Layer w0.3: U1.48 93.18,17.32 88.52,17.32 87.88,17.96 87.88,21.39 79.63,29.64 79.63,37.26 76.84,40.06 v5(65.53,40.06)
PB15: length 67.3
  Top Layer w0.3: U2.7 20.05,75.76 21.08,74.73 21.08,60.88 27.05,54.92 33.15,54.92 35.18,52.88 35.18,48.18 36.45,46.91 v5(42.04,46.91) ; U1.11 54.65,46.49 54.1,47.04 54.1,47.68 52.75,49.03 v5(43.69,49.03)
  Bottom Layer w0.3: v5(43.69,49.03) 43.14,49.03 42.93,48.82 42.93,47.3 42.54,46.91 v5(42.04,46.91)
PB16: length 68.9
  Top Layer w0.3: U1.13 56.09,44.25 54.23,44.25 53.34,45.14 53.34,47.55 52.96,47.93 37.08,47.93 35.94,49.07 35.94,53.39 33.66,55.68 26.92,55.68 21.97,60.63 21.97,76.76 20.43,78.3 U2.8
PB17: length 114.3
  Bottom Layer w0.3: 步进电机1.1 31.37,95.81 32.64,94.54 32.64,73.71 34.16,72.19 53.59,72.19 54.23,71.55 54.23,63.6 54.53,63.3 83.31,63.3 85.3,61.31 85.3,42 85.81,41.49 U1.65
PB18: length 83.7
  Top Layer w0.3: v5(78.36,39.93) 78.87,39.42 84.71,39.42 85.22,38.91 89.53,38.91 90.81,40.18 93.34,40.18 94.49,41.33 U1.66 ; UART2.3 39.37,67.61 40.64,66.34 40.64,58.72 41.28,58.09 46.74,58.09 47.5,57.33 47.5,51.87 v5(48.9,50.47)
  Bottom Layer w0.3: v5(48.9,50.47) 48.99,50.37 77.19,50.37 78.36,49.2 v5(78.36,39.93)
PB19: length 120.3
  Top Layer w0.3: v5(86.23,43.36) v5(86.23,40.31)
  Bottom Layer w0.3: v5(86.23,40.31) 87.59,38.95 U1.63 ; 步进电机1.3 25.78,96.62 26.03,96.87 32.34,96.87 33.27,95.94 33.27,74.98 35.37,72.89 54.17,72.89 54.99,72.06 54.99,64.49 55.29,64.19 83.69,64.19 86.23,61.65 v5(86.23,43.36)
PB20: length 108.1
  Top Layer w0.3: U2.2 17.89,63.06 18.67,62.28 18.67,59.49 22.48,55.68 22.48,47.68 26.03,44.12 32.64,44.12 36.32,40.44 49.4,40.44 50.93,38.91 52.45,38.91 54.1,37.26 54.1,36.12 55.12,35.1 v5(65.53,35.1) ; v5(76.07,35.1) 76.45,35.48 76.45,40.82 77.09,41.45 84.71,41.45 85.22,41.96 85.22,48.31 86.02,49.11 U1.71
  Bottom Layer w0.3: v5(65.53,35.1) v5(76.07,35.1)
PB21: length 126.6
  Top Layer w0.3: v5(31.1,77.14) 31.1,74.11 32,73.2 52.07,73.2 53.04,72.23 v5(53.04,70.79)
  Bottom Layer w0.3: 步进电机1.4 25.78,91.87 26.67,90.98 30.69,90.98 31.98,89.69 31.98,78.03 31.1,77.15 v5(31.1,77.14) ; U1.55 91.91,28.75 87,28.75 84.2,31.55 84.2,61.01 82.68,62.53 53.72,62.53 53.04,63.21 v5(53.04,70.79)
PB22: length 131.7
  Top Layer w0.3: v5(52.07,70.66) 52.07,71.81 51.44,72.44 31.37,72.44 30.23,73.58 v5(30.23,74.98)
  Bottom Layer w0.3: U1.56 94.49,28.37 93.73,27.61 92.46,27.61 92.45,27.59 91.45,27.59 91.43,27.61 86.74,27.61 83.06,31.29 83.06,59.87 81.15,61.77 52.83,61.77 52.07,62.53 v5(52.07,70.66) ; 步进电机1.6 23.24,78.92 24.89,77.27 29.84,77.27 30.23,76.89 v5(30.23,74.98)
PB23: length 118.2
  Top Layer w0.3: U1.31 57.59,22.29 59.43,22.29 59.44,22.28 61.47,22.28 61.72,22.53 61.72,26.97 61.21,27.48 55.12,27.48 53.72,26.09 28.45,26.09 26.03,28.5 26.03,42.85 25.02,43.87 23.67,43.87 v5(22.35,45.18)
  Bottom Layer w0.3: 步进电机1.5 21.97,94.54 21.97,54.79 22.35,54.41 22.35,52.35 22.36,52.34 22.36,51.39 22.35,51.38 v5(22.35,45.18)
PB24: length 78.7
  Top Layer w0.3: v5(78.74,31.42) 85.85,31.42 89.66,27.61 91.43,27.61 91.45,27.59 94.99,27.59 95,27.61 97.03,27.61 97.54,28.12 97.54,50.72 96.61,51.65 U1.74
  Bottom Layer w0.3: 蜂鸣器1.2 51.18,35.36 53.97,32.56 65.91,32.56 67.06,31.42 v5(78.74,31.42)
PB25: length 110.4
  Inner2 w0.3: U1.73 91.4,51.65 89.79,53.26 89.79,55.93 89.15,56.57 85.85,56.57 85.09,57.33 85.09,62.41 83.06,64.44 57.78,64.44 55.75,66.47 55.75,78.35 54.74,79.36 49.59,79.36 47.88,77.65 47.88,73.97 46.74,72.82 43.69,72.82 41.02,70.16 41.02,60.63 40.13,59.74 29.59,59.74 26.29,56.44 空余引脚.8
PB26: length 101.4
  Inner2 w0.3: 空余引脚.9 28.83,49.07 24.77,45.01 24.77,29.9 28.83,25.83 36.45,25.83 38.35,23.93 v5(38.35,17.7) ; v5(54.88,8.56) 53.21,8.56 51.82,9.96 39.37,9.96 38.35,10.97 v5(38.35,13.58)
  Bottom Layer w0.3: U1.32 59.98,21.09 60.71,20.37 60.71,18.38 61.01,18.09 66.8,18.09 67.52,17.37 67.52,16.61 67.22,16.31 62.1,16.31 61.09,15.29 61.09,9.83 59.82,8.56 v5(54.88,8.56) ; v5(38.35,17.7) v5(38.35,13.58)
PB27: length 63.7
  Inner2 w0.3: 空余引脚.10 31.37,47.8 28.57,45.01 26.67,45.01 25.53,43.87 25.53,30.28 29.21,26.59 38.99,26.59 40.39,25.2 47.62,25.2 48.64,24.18 48.64,19.35 49.15,18.85 56.09,18.85 U1.33
$1N2097: length 3.4
  Top Layer w0.8: R2470.2 85.3,77.01 独立5V供电.2
$1N2098: length 2.9
  Top Layer w0.8: LED1驱动板1.2 61.08,80.61 R1470.2
$1N2102: length 2.6
  Top Layer w0.8: LED5V1.2 57.91,77.82 R3470.2
$1N3077: length 3.9
  Top Layer w1.2: R31800.2 88.6,97.59 LED12V.2
$1N6588: length 2.5
  Top Layer w0.3: LED11.2 13.11,18.66 R41k4.1
$1N6591: length 2.6
  Top Layer w0.3: LED12.2 16.64,18.76 R41k1.1
$1N6592: length 2.5
  Top Layer w0.3: R41k2.1 20.45,18.51 LED15.2
$1N6593: length 2.2
  Top Layer w0.3: R41k3.1 43.31,17.72 LED16.2
$1N6603: length 2.2
  Top Layer w0.3: LED17.2 46.74,17.75 R41k5.1
$1N6604: length 2.4
  Top Layer w0.3: LED18.2 50.43,17.75 R41k6.1
$1N7225: length 9.5
  Top Layer w1.2: D2.2 67.93,94.43 67.31,95.05 INT+1.1

## Copper pours and planes (outline as drawn; the poured copper is in the pictures)
GND on Top Layer: -5.21,103.68 77.09,103.68 79.88,100.89 79.88,95.17 80.14,94.92 79.76,94.54 79.76,92.89 75.44,92.89 75.18,92.63 75.18,84 75.06,83.87 64.39,83.87 64.26,83.74 64.26,76.89 64.52,76.63 77.47,76.63 77.98,77.14 77.98,79.55 88.14,79.55 88.65,80.06 88.65,84.89 89.41,85.65 89.41,94.16 89.28,94.28 80.92,94.28 80.65,94.56 80.65,103.68 81.28,104.32 108.33,104.06 110.24,101.91 110.87,-0.58 102.74,-8.71 -18.42,-8.71 -20.57,-6.55 -20.57,91.11 -12.06,99.62 -9.27,99.62
GND on Bottom Layer: -5.97,103.81 76.71,103.81 79.88,100.63 79.88,93.02 80.01,92.89 79.88,92.76 75.69,92.76 75.69,86.03 75.82,85.9 75.82,83.87 76.07,83.62 65.02,83.62 64.9,83.49 64.9,76.87 64.64,76.62 77.27,76.62 78.23,77.57 78.23,80.31 87.63,80.31 88.14,79.81 88.52,80.19 88.52,85.39 89.41,86.28 89.41,93.52 81.79,93.52 81.41,93.14 81.41,94.34 80.65,95.1 80.65,101.91 81.03,102.29 105.93,102.29 107.7,100.63 107.7,-5.41 106.04,-7.06 -0.25,-7.06 -4.06,-3.25 -4.06,101.91
GND on Inner2: -7.11,103.3 77.34,103.3 79.88,100.76 79.88,93.4 79.55,93.06 75.23,93.06 75.23,83.77 75.13,83.67 64.64,83.67 64.64,76.89 64.77,76.76 77.14,76.76 77.34,76.97 77.34,79.43 77.98,80.06 87.63,80.06 87.88,79.81 88.39,80.31 88.39,86.67 89.53,87.81 89.53,93.52 80.52,93.52 80.39,93.4 80.39,102.29 80.65,102.55 102.28,102.29 102.62,102.29 102.62,-6.43 97.66,-11.38 2.29,-11.38 -4.83,-4.27 -4.83,101.02

Small or netless copper shapes (teardrops, artwork), in the pictures only: 200 on Top Layer, 132 on Bottom Layer, 143 on Inner1, 25 on Inner2

## Text on the board
Top Silkscreen Layer: U1 | J1 | J2 | Rlaserb1k | Rlaserc1k | OLED1 | U2 | U3 | Q4 | A29 | A30 | 5V | A17 | A18 | 3.3V | G | B00 | CS0B20 | SCLKB16 | PICOB15 | POCIB14 | A07 | A31 | B08 | B01 | B09 | SCLA11 | B25 | B02 | B26 | SDAA10 | B27 | B03 | CS0A2 | POCIA13 | B06 | PICOA14 | A09 | SCLKA12 | A08 | SDAA16 | SCLA15 | B07 | 5V2 | 12V | 5V1 | 2 | Y | X | 1 | ST2 | ST1 | DIR2 | DIR1 | EN2 | EN1 | ADC | SW | 摇杆 | TXD单A00 | TXD单A23 | TXD单B12 | TXD单B04 | 驱动板供电 | 降压供电 | 开 | 关 | 3v3
